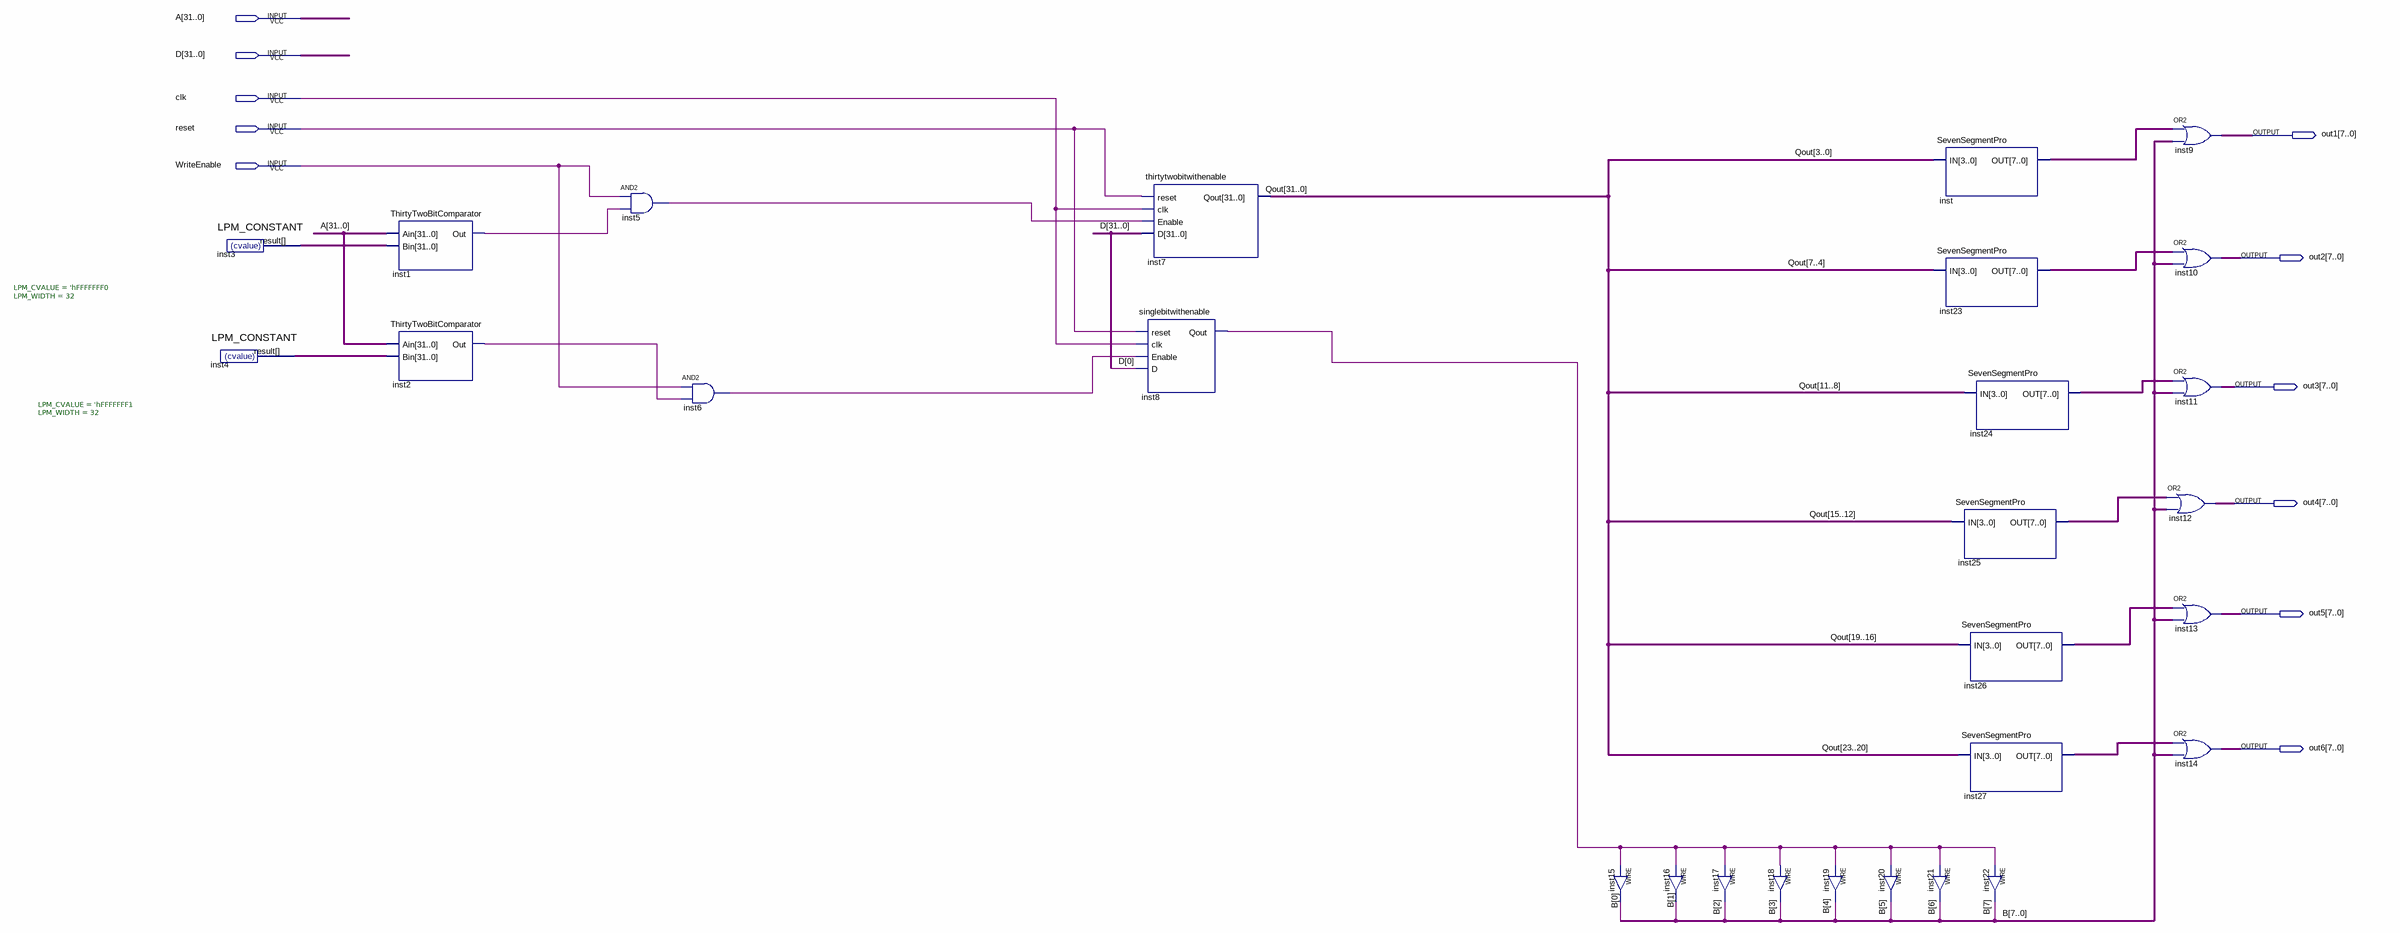
[diagram p0: schematic sheet]
// Quartus schematic DisplayDrive_new.bdf as structural Verilog: 28 symbols, 11 pins
module DisplayDrive_new (
  input  [31:0] A,
  input  [31:0] D,
  input  clk,
  input  reset,
  input  WriteEnable,
  output [7:0] out1,
  output [7:0] out2,
  output [7:0] out3,
  output [7:0] out4,
  output [7:0] out5,
  output [7:0] out6
);

  wire inst1_out, inst2_out, inst5_out, inst6_out, inst8_qout;
  wire [7:0] B, inst23_out, inst24_out, inst25_out, inst26_out, inst27_out, inst_out;
  wire [31:0] inst3_result, inst4_result, Qout;

  LPM_CONSTANT #(.LPM_CVALUE('hFFFFFFF0), .LPM_WIDTH(32)) inst3 (.result(inst3_result));
  LPM_CONSTANT #(.LPM_CVALUE('hFFFFFFF1), .LPM_WIDTH(32)) inst4 (.result(inst4_result));
  ThirtyTwoBitComparator inst1 (.Ain(A), .Bin(inst3_result), .Out(inst1_out));
  ThirtyTwoBitComparator inst2 (.Ain(A), .Bin(inst4_result), .Out(inst2_out));
  and inst5 (inst5_out, WriteEnable, inst1_out);
  and inst6 (inst6_out, WriteEnable, inst2_out);
  thirtytwobitwithenable inst7 (.reset(reset), .clk(clk), .Enable(inst5_out), .D(D), .Qout(Qout));
  singlebitwithenable inst8 (.reset(reset), .clk(clk), .Enable(inst6_out), .D(D[0]), .Qout(inst8_qout));
  assign B[0] = inst8_qout;  // WIRE inst15
  assign B[1] = inst8_qout;  // WIRE inst16
  assign B[2] = inst8_qout;  // WIRE inst17
  assign B[3] = inst8_qout;  // WIRE inst18
  assign B[4] = inst8_qout;  // WIRE inst19
  assign B[5] = inst8_qout;  // WIRE inst20
  SevenSegmentPro inst (.IN(Qout[3:0]), .OUT(inst_out));
  SevenSegmentPro inst23 (.IN(Qout[7:4]), .OUT(inst23_out));
  assign B[6] = inst8_qout;  // WIRE inst21
  SevenSegmentPro inst24 (.IN(Qout[11:8]), .OUT(inst24_out));
  SevenSegmentPro inst25 (.IN(Qout[15:12]), .OUT(inst25_out));
  SevenSegmentPro inst26 (.IN(Qout[19:16]), .OUT(inst26_out));
  SevenSegmentPro inst27 (.IN(Qout[23:20]), .OUT(inst27_out));
  assign B[7] = inst8_qout;  // WIRE inst22
  assign out1 = inst_out | B;  // OR2 inst9, 8 bits wide
  assign out2 = inst23_out | B;  // OR2 inst10, 8 bits wide
  assign out3 = inst24_out | B;  // OR2 inst11, 8 bits wide
  assign out4 = inst25_out | B;  // OR2 inst12, 8 bits wide
  assign out5 = inst26_out | B;  // OR2 inst13, 8 bits wide
  assign out6 = inst27_out | B;  // OR2 inst14, 8 bits wide
endmodule
